# EAGLE design EmitterFollower (EAGLE 7.2.0)
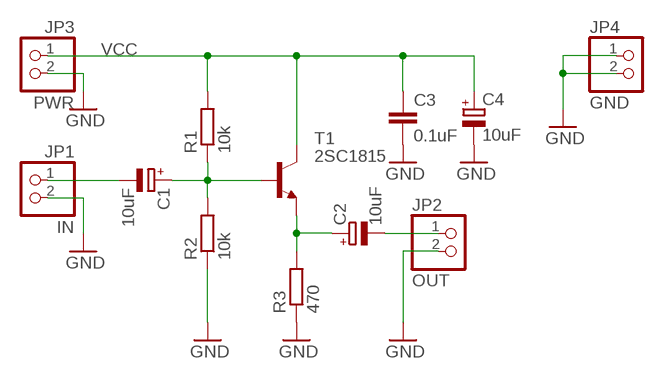
[diagram p0: schematic, sheet 1]

## Parts
C1  10uF  CPOL-EUE2.5-6  [E2,5-6]
C2  10uF  CPOL-EUE2.5-6  [E2,5-6]
C3  0.1uF  C-EU050-024X044  [C050-024X044]
C4  10uF  CPOL-EUE2.5-6  [E2,5-6]
JP1  IN  PINHD-1X2  [1X02]
JP2  OUT  PINHD-1X2  [1X02]
JP3  PWR  PINHD-1X2  [1X02]
JP4  GND  PINHD-1X2  [1X02]
R1  10k  R-EU_0207/7  [0207/7]
R2  10k  R-EU_0207/7  [0207/7]
R3  470  R-EU_0207/7  [0207/7]
T1  2SC1815  -NPN-TO92-ECB  [TO92-ECB]

## Nets
GND: C3.2 C4.- JP1.2 JP2.2 JP3.2 JP4.1 JP4.2 R2.1 R3.1
N$1: C1.- JP1.1
N$2: C1.+ R1.1 R2.2 T1.B
N$3: C2.- JP2.1
N$4: C2.+ R3.2 T1.E
VCC: C3.1 C4.+ JP3.1 R1.2 T1.C

## Library data of the parts
C1 C2 C4 = rcl:CPOL-EU: POLARIZED CAPACITOR, European symbol
C3 = rcl:C-EU: CAPACITOR, European symbol
JP1-JP4 = pinhead:PINHD-1X2: PIN HEADER
R1-R3 = rcl:R-EU_: RESISTOR, European symbol
T1 = transistor:*-NPN-: NPN Transistror BF959 corrected 2008.03.06

## Board
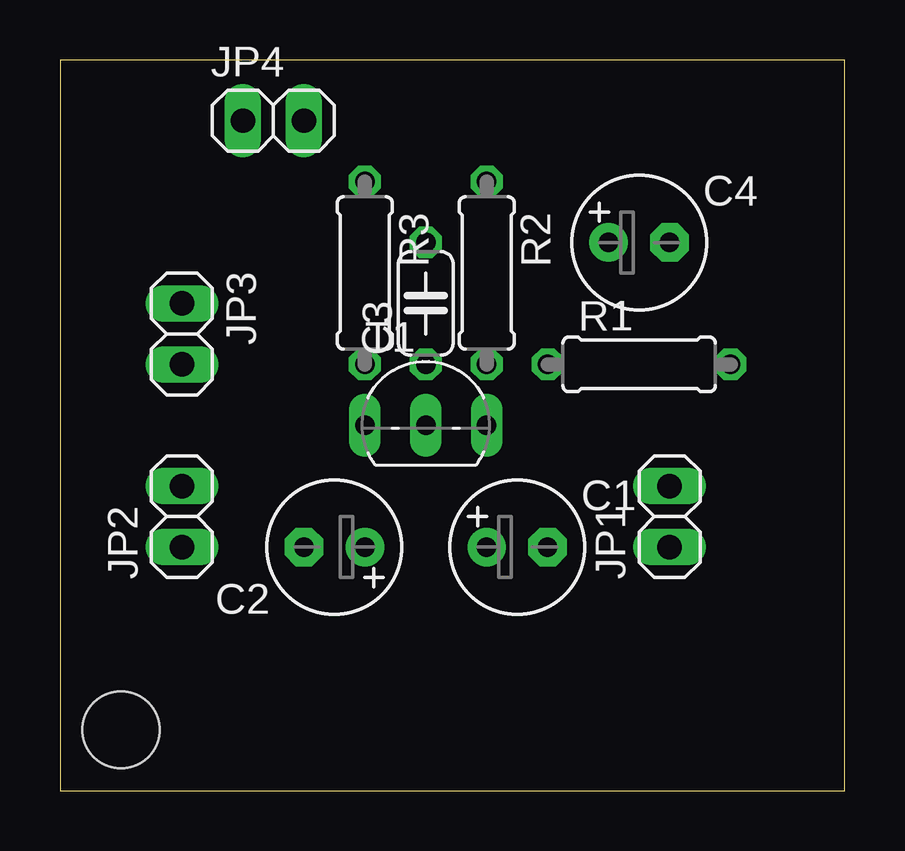
[diagram p1: board, top side]
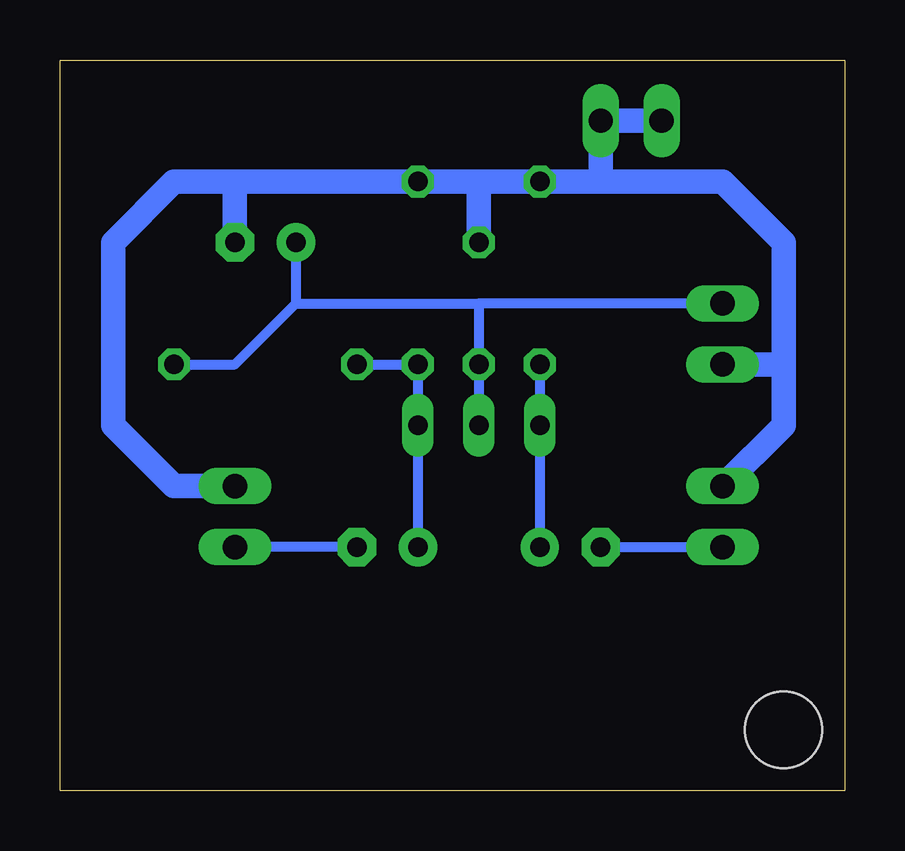
[diagram p2: board, bottom side, seen from below]

Size 32.69 x 30.47 mm. Coordinates in mm from the lower left corner, seen from the top.
Outline: 0,0 32.69,0 32.69,30.47 0,30.47 0,0
Copper layers (1*16): Top 0.035mm / dielectric 1.5mm / Bottom 0.035mm
Design rules "default": minimum track width 10mil, minimum drill 24mil, track to track 8mil, track to pad 8mil, pad to pad 8mil, via to via 8mil, smd to smd 8mil, copper to edge 40mil, drill to drill 8mil, minimum pad ring 10mil, minimum via ring 8mil, stop-mask expansion 4mil, vias tented up to drill 0mil, thermal gap 10mil
Holes 3.2 mm at 2.54,2.54

### Footprints (pad centres in the part's own frame; a part is rotated, then mirrored left to right if it is on the bottom)
E2,5-6 = drill 0.813 pad 1.6: + -1.27,0 | drill 0.813 pad 1.6 octagon: - 1.27,0
C050-024X044 = drill 0.813 octagon: 1 -2.54,0; 2 2.54,0
1X02 = drill 1.016 long: 1 -1.27,0; 2 1.27,0
0207/7 = drill 0.813 octagon: 1 -3.81,0; 2 3.81,0
TO92-ECB = drill 0.813 long: B 2.54,0; C 0,0; E -2.54,0

### Placement (x,y rotation side)
C1  19.05,10.16 0 top
C2  11.43,10.16 180 top
C3  15.24,20.32 90 top
C4  24.13,22.86 0 top
JP1  25.4,11.43 90 top
JP2  5.08,11.43 90 top
JP3  5.08,19.05 270 top
JP4  8.89,27.94 0 top
R1  24.13,17.78 0 top
R2  17.78,21.59 270 top
R3  12.7,21.59 270 top
T1  15.24,15.24 0 top

### Tracks (layer width: path | path; a pad name or v marks a point on that pad's centre or on a via)
GND
  Bottom 1.016: 10.16,25.4 5.08,25.4 2.54,22.86 2.54,17.78 | 10.16,25.4 R3.1 15.24,25.4 | 15.24,25.4 R2.1 25.4,25.4 | 25.4,25.4 C4.- | 25.4,25.4 27.94,25.4 30.48,22.86 30.48,15.24 27.94,12.7 JP1.2 | JP2.2 2.54,15.24 2.54,17.78 | JP3.2 2.54,17.78 | C3.2 15.24,25.4 | 10.16,25.4 JP4.2 JP4.1
N$1
  Bottom 0.406: C1.- JP1.1
N$2
  Bottom 0.406: R1.1 R2.2 T1.B C1.+
N$3
  Bottom 0.406: C2.- JP2.1
N$4
  Bottom 0.406: R3.2 T1.E C2.+
VCC
  Bottom 0.406: R1.2 25.4,17.78 22.86,20.32 | C4.+ 22.86,20.32 | JP3.1 15.24,20.32 | 15.24,20.32 C3.1 T1.C | 22.86,20.32 15.24,20.32